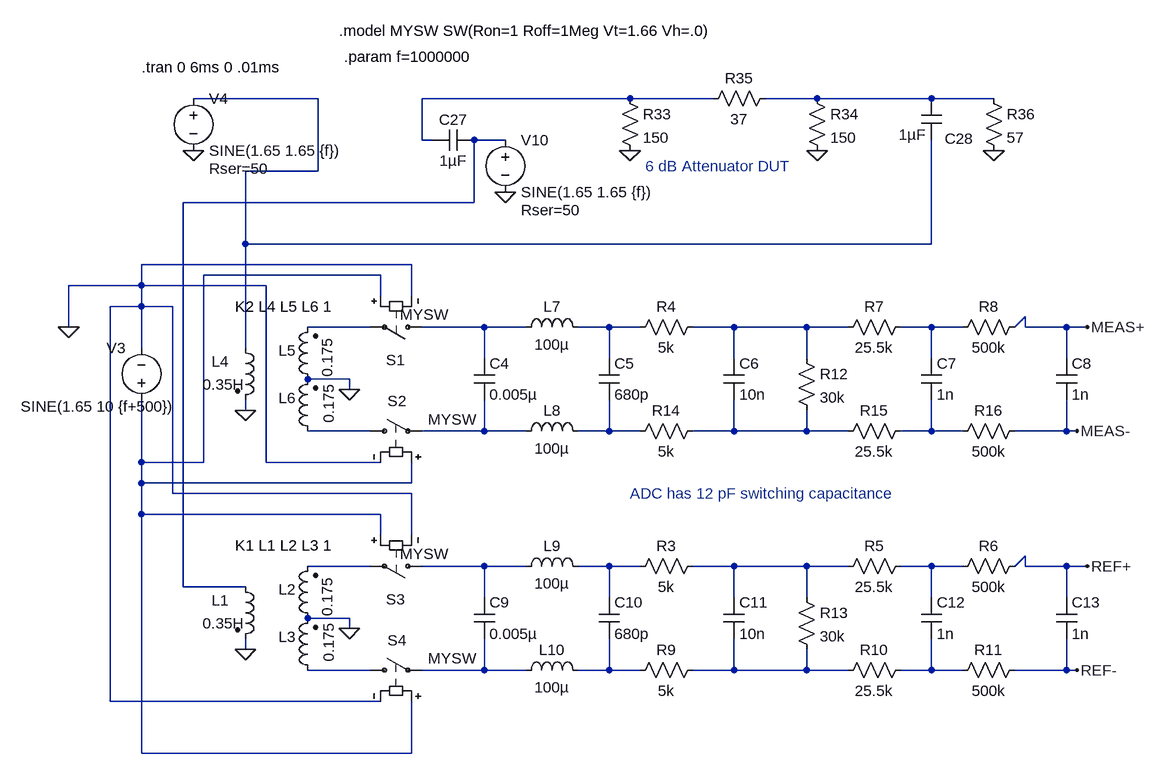
[diagram p0: schematic DiffVNALPFonly.asc]
DiffVNALPFonly.asc, the LTspice schematic file:
Version 4
SHEET 1 2648 1860
WIRE -64 64 -256 64
WIRE 416 64 96 64
WIRE 544 64 416 64
WIRE 704 64 624 64
WIRE 880 64 704 64
WIRE 976 64 880 64
WIRE 96 128 96 64
WIRE 112 128 96 128
WIRE 224 128 176 128
WIRE -64 176 -64 64
WIRE -64 176 -176 176
WIRE 176 224 176 128
WIRE 176 224 -272 224
WIRE -176 288 -176 176
WIRE 880 288 880 128
WIRE 880 288 -176 288
WIRE 80 320 -336 320
WIRE 32 336 -240 336
WIRE -336 352 -336 320
WIRE -336 352 -448 352
WIRE -144 352 -336 352
WIRE 32 368 32 336
WIRE 80 368 80 320
WIRE -336 384 -336 352
WIRE -336 384 -384 384
WIRE -288 384 -336 384
WIRE -448 416 -448 352
WIRE 16 416 -80 416
WIRE 192 416 96 416
WIRE 256 416 192 416
WIRE 384 416 336 416
WIRE 432 416 384 416
WIRE 576 416 512 416
WIRE 688 416 576 416
WIRE 752 416 688 416
WIRE 880 416 832 416
WIRE 928 416 880 416
WIRE 1008 416 1024 400
WIRE 1024 416 1024 400
WIRE 1088 416 1024 416
WIRE 1120 416 1088 416
WIRE -336 448 -336 384
WIRE -176 448 -176 288
WIRE 192 464 192 416
WIRE 384 464 384 416
WIRE 576 464 576 416
WIRE 688 464 688 416
WIRE 880 464 880 416
WIRE 1088 464 1088 416
WIRE -16 496 -80 496
WIRE -16 512 -16 496
WIRE -176 544 -176 528
WIRE 16 576 -80 576
WIRE 192 576 192 528
WIRE 192 576 96 576
WIRE 256 576 192 576
WIRE 384 576 384 528
WIRE 384 576 336 576
WIRE 432 576 384 576
WIRE 576 576 576 528
WIRE 576 576 512 576
WIRE 688 576 688 544
WIRE 688 576 576 576
WIRE 752 576 688 576
WIRE 880 576 880 528
WIRE 880 576 832 576
WIRE 928 576 880 576
WIRE 1088 576 1088 528
WIRE 1088 576 1008 576
WIRE 1104 576 1088 576
WIRE -336 624 -336 528
WIRE -240 624 -240 336
WIRE -240 624 -336 624
WIRE -144 624 -144 352
WIRE 32 624 -144 624
WIRE -336 656 -336 624
WIRE 80 656 80 624
WIRE 80 656 -336 656
WIRE -288 672 -288 384
WIRE 80 672 -288 672
WIRE -336 704 -336 656
WIRE 32 704 -336 704
WIRE 32 736 32 704
WIRE 80 736 80 672
WIRE 16 784 -80 784
WIRE 192 784 96 784
WIRE 256 784 192 784
WIRE 384 784 336 784
WIRE 432 784 384 784
WIRE 576 784 512 784
WIRE 688 784 576 784
WIRE 752 784 688 784
WIRE 880 784 832 784
WIRE 928 784 880 784
WIRE 1008 784 1024 768
WIRE 1024 784 1024 768
WIRE 1088 784 1024 784
WIRE 1120 784 1088 784
WIRE -272 816 -272 224
WIRE -176 816 -272 816
WIRE 192 832 192 784
WIRE 384 832 384 784
WIRE 576 832 576 784
WIRE 688 832 688 784
WIRE 880 832 880 784
WIRE 1088 832 1088 784
WIRE -16 864 -80 864
WIRE -16 880 -16 864
WIRE -176 912 -176 896
WIRE 16 944 -80 944
WIRE 192 944 192 896
WIRE 192 944 96 944
WIRE 256 944 192 944
WIRE 384 944 384 896
WIRE 384 944 336 944
WIRE 432 944 384 944
WIRE 576 944 576 896
WIRE 576 944 512 944
WIRE 688 944 688 912
WIRE 688 944 576 944
WIRE 752 944 688 944
WIRE 880 944 880 896
WIRE 880 944 832 944
WIRE 928 944 880 944
WIRE 1088 944 1088 896
WIRE 1088 944 1008 944
WIRE 1104 944 1088 944
WIRE -384 992 -384 384
WIRE 32 992 -384 992
WIRE -336 1072 -336 704
WIRE 80 1072 80 992
WIRE 80 1072 -336 1072
FLAG -256 144 0
FLAG 1120 416 MEAS+
FLAG 1104 576 MEAS-
FLAG -176 544 0
FLAG 1120 784 REF+
FLAG 1104 944 REF-
FLAG -176 912 0
FLAG -448 416 0
FLAG -16 512 0
FLAG -16 880 0
FLAG 224 208 0
FLAG 704 144 0
FLAG 416 144 0
FLAG 976 144 0
SYMBOL res 528 400 R90
WINDOW 0 0 56 VBottom 2
WINDOW 3 32 56 VTop 2
SYMATTR InstName R4
SYMATTR Value 5k
SYMBOL res 848 400 R90
WINDOW 0 0 56 VBottom 2
WINDOW 3 32 56 VTop 2
SYMATTR InstName R7
SYMATTR Value 25.5k
SYMBOL res 1024 400 R90
WINDOW 0 0 56 VBottom 2
WINDOW 3 32 56 VTop 2
SYMATTR InstName R8
SYMATTR Value 500k
SYMBOL res 528 560 R90
WINDOW 0 0 56 VBottom 2
WINDOW 3 32 56 VTop 2
SYMATTR InstName R14
SYMATTR Value 5k
SYMBOL res 848 560 R90
WINDOW 0 0 56 VBottom 2
WINDOW 3 32 56 VTop 2
SYMATTR InstName R15
SYMATTR Value 25.5k
SYMBOL res 1024 560 R90
WINDOW 0 0 56 VBottom 2
WINDOW 3 32 56 VTop 2
SYMATTR InstName R16
SYMATTR Value 500k
SYMBOL sw 112 416 R90
WINDOW 0 51 42 VRight 2
WINDOW 3 -19 -24 VRight 2
SYMATTR InstName S1
SYMATTR Value MYSW
SYMBOL sw 0 576 R270
WINDOW 0 46 43 VRight 2
WINDOW 3 18 105 VRight 2
SYMATTR InstName S2
SYMATTR Value MYSW
SYMBOL ind2 -192 432 R0
WINDOW 0 -36 37 Left 2
WINDOW 3 -50 72 Left 2
SYMATTR InstName L4
SYMATTR Value 0.35H
SYMATTR SpiceLine Ipk=0.43 Rser=2.58 Rpar=94200 Cpar=0
SYMATTR Type ind
SYMBOL ind2 -64 512 R180
WINDOW 0 34 60 Left 2
WINDOW 3 -14 79 VLeft 2
SYMATTR InstName L5
SYMATTR Value 0.175
SYMATTR Type ind
SYMBOL ind2 -64 592 R180
WINDOW 0 34 67 Left 2
WINDOW 3 -16 28 VRight 2
SYMATTR InstName L6
SYMATTR Value 0.175
SYMATTR Type ind
SYMBOL ind2 -192 800 R0
WINDOW 0 -36 37 Left 2
WINDOW 3 -50 72 Left 2
SYMATTR InstName L1
SYMATTR Value 0.35H
SYMATTR SpiceLine Ipk=0.43 Rser=2.58 Rpar=94200 Cpar=0
SYMATTR Type ind
SYMBOL ind2 -64 880 R180
WINDOW 0 34 60 Left 2
WINDOW 3 -14 79 VLeft 2
SYMATTR InstName L2
SYMATTR Value 0.175
SYMATTR Type ind
SYMBOL ind2 -64 960 R180
WINDOW 0 34 67 Left 2
WINDOW 3 -16 28 VRight 2
SYMATTR InstName L3
SYMATTR Value 0.175
SYMATTR Type ind
SYMBOL sw 112 784 R90
WINDOW 0 51 42 VRight 2
WINDOW 3 -19 -24 VRight 2
SYMATTR InstName S3
SYMATTR Value MYSW
SYMBOL sw 0 944 R270
WINDOW 0 46 43 VRight 2
WINDOW 3 18 105 VRight 2
SYMATTR InstName S4
SYMATTR Value MYSW
SYMBOL ind 240 432 R270
WINDOW 0 32 56 VTop 2
WINDOW 3 5 56 VBottom 2
SYMATTR InstName L7
SYMATTR Value 100µ
SYMBOL ind 240 592 R270
WINDOW 0 32 56 VTop 2
WINDOW 3 5 56 VBottom 2
SYMATTR InstName L8
SYMATTR Value 100µ
SYMBOL cap 176 464 R0
SYMATTR InstName C4
SYMATTR Value 0.005µ
SYMBOL cap 368 464 R0
SYMATTR InstName C5
SYMATTR Value 680p
SYMBOL cap 560 464 R0
SYMATTR InstName C6
SYMATTR Value 10n
SYMBOL cap 864 464 R0
SYMATTR InstName C7
SYMATTR Value 1n
SYMBOL cap 1072 464 R0
SYMATTR InstName C8
SYMATTR Value 1n
SYMBOL cap 176 832 R0
SYMATTR InstName C9
SYMATTR Value 0.005µ
SYMBOL res 672 448 R0
SYMATTR InstName R12
SYMATTR Value 30k
SYMBOL voltage -336 544 R180
WINDOW 0 24 96 Left 2
WINDOW 3 -52 6 Left 2
WINDOW 123 0 0 Left 2
WINDOW 39 0 0 Left 2
SYMATTR InstName V3
SYMATTR Value SINE(1.65 10 {f+500})
SYMBOL res 528 768 R90
WINDOW 0 0 56 VBottom 2
WINDOW 3 32 56 VTop 2
SYMATTR InstName R3
SYMATTR Value 5k
SYMBOL res 848 768 R90
WINDOW 0 0 56 VBottom 2
WINDOW 3 32 56 VTop 2
SYMATTR InstName R5
SYMATTR Value 25.5k
SYMBOL res 1024 768 R90
WINDOW 0 0 56 VBottom 2
WINDOW 3 32 56 VTop 2
SYMATTR InstName R6
SYMATTR Value 500k
SYMBOL res 528 928 R90
WINDOW 0 0 56 VBottom 2
WINDOW 3 32 56 VTop 2
SYMATTR InstName R9
SYMATTR Value 5k
SYMBOL res 848 928 R90
WINDOW 0 0 56 VBottom 2
WINDOW 3 32 56 VTop 2
SYMATTR InstName R10
SYMATTR Value 25.5k
SYMBOL res 1024 928 R90
WINDOW 0 0 56 VBottom 2
WINDOW 3 32 56 VTop 2
SYMATTR InstName R11
SYMATTR Value 500k
SYMBOL ind 240 800 R270
WINDOW 0 32 56 VTop 2
WINDOW 3 5 56 VBottom 2
SYMATTR InstName L9
SYMATTR Value 100µ
SYMBOL ind 240 960 R270
WINDOW 0 32 56 VTop 2
WINDOW 3 5 56 VBottom 2
SYMATTR InstName L10
SYMATTR Value 100µ
SYMBOL cap 368 832 R0
SYMATTR InstName C10
SYMATTR Value 680p
SYMBOL cap 560 832 R0
SYMATTR InstName C11
SYMATTR Value 10n
SYMBOL cap 864 832 R0
SYMATTR InstName C12
SYMATTR Value 1n
SYMBOL cap 1072 832 R0
SYMATTR InstName C13
SYMATTR Value 1n
SYMBOL res 672 816 R0
SYMATTR InstName R13
SYMATTR Value 30k
SYMBOL voltage -256 48 R0
WINDOW 123 0 0 Left 2
WINDOW 39 24 124 Left 2
SYMATTR SpiceLine Rser=50
SYMATTR InstName V4
SYMATTR Value SINE(1.65 1.65 {f})
SYMBOL voltage 224 112 R0
WINDOW 123 0 0 Left 2
WINDOW 39 24 124 Left 2
SYMATTR SpiceLine Rser=50
SYMATTR InstName V10
SYMATTR Value SINE(1.65 1.65 {f})
SYMBOL cap 176 112 R90
WINDOW 0 0 32 VBottom 2
WINDOW 3 32 32 VTop 2
SYMATTR InstName C27
SYMATTR Value 1µF
SYMBOL res 400 48 R0
SYMATTR InstName R33
SYMATTR Value 150
SYMBOL res 688 48 R0
SYMATTR InstName R34
SYMATTR Value 150
SYMBOL res 640 48 R90
WINDOW 0 0 56 VBottom 2
WINDOW 3 32 56 VTop 2
SYMATTR InstName R35
SYMATTR Value 37
SYMBOL cap 896 128 R180
WINDOW 0 -49 2 Left 2
WINDOW 3 24 8 Left 2
SYMATTR InstName C28
SYMATTR Value 1µF
SYMBOL res 960 48 R0
SYMATTR InstName R36
SYMATTR Value 57
TEXT -336 16 Left 2 !.tran 0 6ms 0 .01ms
TEXT 416 672 Left 2 ;ADC has 12 pF switching capacitance
TEXT -192 752 Left 2 !K1 L1 L2 L3 1
TEXT -192 384 Left 2 !K2 L4 L5 L6 1
TEXT -32 -40 Left 2 !.model MYSW SW(Ron=1 Roff=1Meg Vt=1.66 Vh=.0)
TEXT -24 0 Left 2 !.param f=1000000
TEXT 440 168 Left 2 ;6 dB Attenuator DUT

The netlist it stands for:
* DiffVNALPFonly.asc
R4 N009 N008 5k
R7 N010 N009 25.5k
R8 MEAS+ N010 500k
R14 N014 N013 5k
R15 N015 N014 25.5k
R16 MEAS- N015 500k
S1 N007 N006 N005 0 MYSW
S2 N011 N012 N005 0 MYSW
L4 N001 0 0.35H Ipk=0.43 Rser=2.58 Rpar=94200 Cpar=0
L5 0 N006 0.175
L6 N011 0 0.175
L1 N004 0 0.35H Ipk=0.43 Rser=2.58 Rpar=94200 Cpar=0
L2 0 N016 0.175
L3 N021 0 0.175
S3 N017 N016 N005 0 MYSW
S4 N021 N022 N005 0 MYSW
L7 N007 N008 100µ
L8 N012 N013 100µ
C4 N007 N012 0.005µ
C5 N008 N013 680p
C6 N009 N014 10n
C7 N010 N015 1n
C8 MEAS+ MEAS- 1n
C9 N017 N022 0.005µ
R12 N009 N014 30k
V3 N005 0 SINE(1.65 10 {f+500})
R3 N019 N018 5k
R5 N020 N019 25.5k
R6 REF+ N020 500k
R9 N024 N023 5k
R10 N025 N024 25.5k
R11 REF- N025 500k
L9 N017 N018 100µ
L10 N022 N023 100µ
C10 N018 N023 680p
C11 N019 N024 10n
C12 N020 N025 1n
C13 REF+ REF- 1n
R13 N019 N024 30k
V4 N001 0 SINE(1.65 1.65 {f}) Rser=50
V10 N004 0 SINE(1.65 1.65 {f}) Rser=50
C27 N004 N002 1µF
R33 N002 0 150
R34 N003 0 150
R35 N003 N002 37
C28 N001 N003 1µF
R36 N003 0 57
.tran 0 6ms 0 .01ms
* ADC has 12 pF switching capacitance
K1 L1 L2 L3 1
K2 L4 L5 L6 1
.model MYSW SW(Ron=1 Roff=1Meg Vt=1.66 Vh=.0)
.param f=1000000
* 6 dB Attenuator DUT
.backanno
.end